# Altium schematic sheet MPU.SchDoc
size 420 x 297 mm; Address1: Address1; Address2: Address2; Address3: Address3; Address4: Address4; SheetNumber: 1; Scale: 1:1; Разраб.: Иванов; Обозначение документа: АБВГ.123456.001 Э3; Пров.: Петров; Утв.: Сидоров; Наименование организации: ОАО "Концерн "МПО-Гидроприбор"; Перв. применение: АБВГ.123456.000; Наименование изделия 1: Плата; Наименование изделия 2: Схема электрическая; Наименование изделия 3: принципиальная; Нач. отд.: Нач. отд.; Фамилия нач. отд.: Сидоров
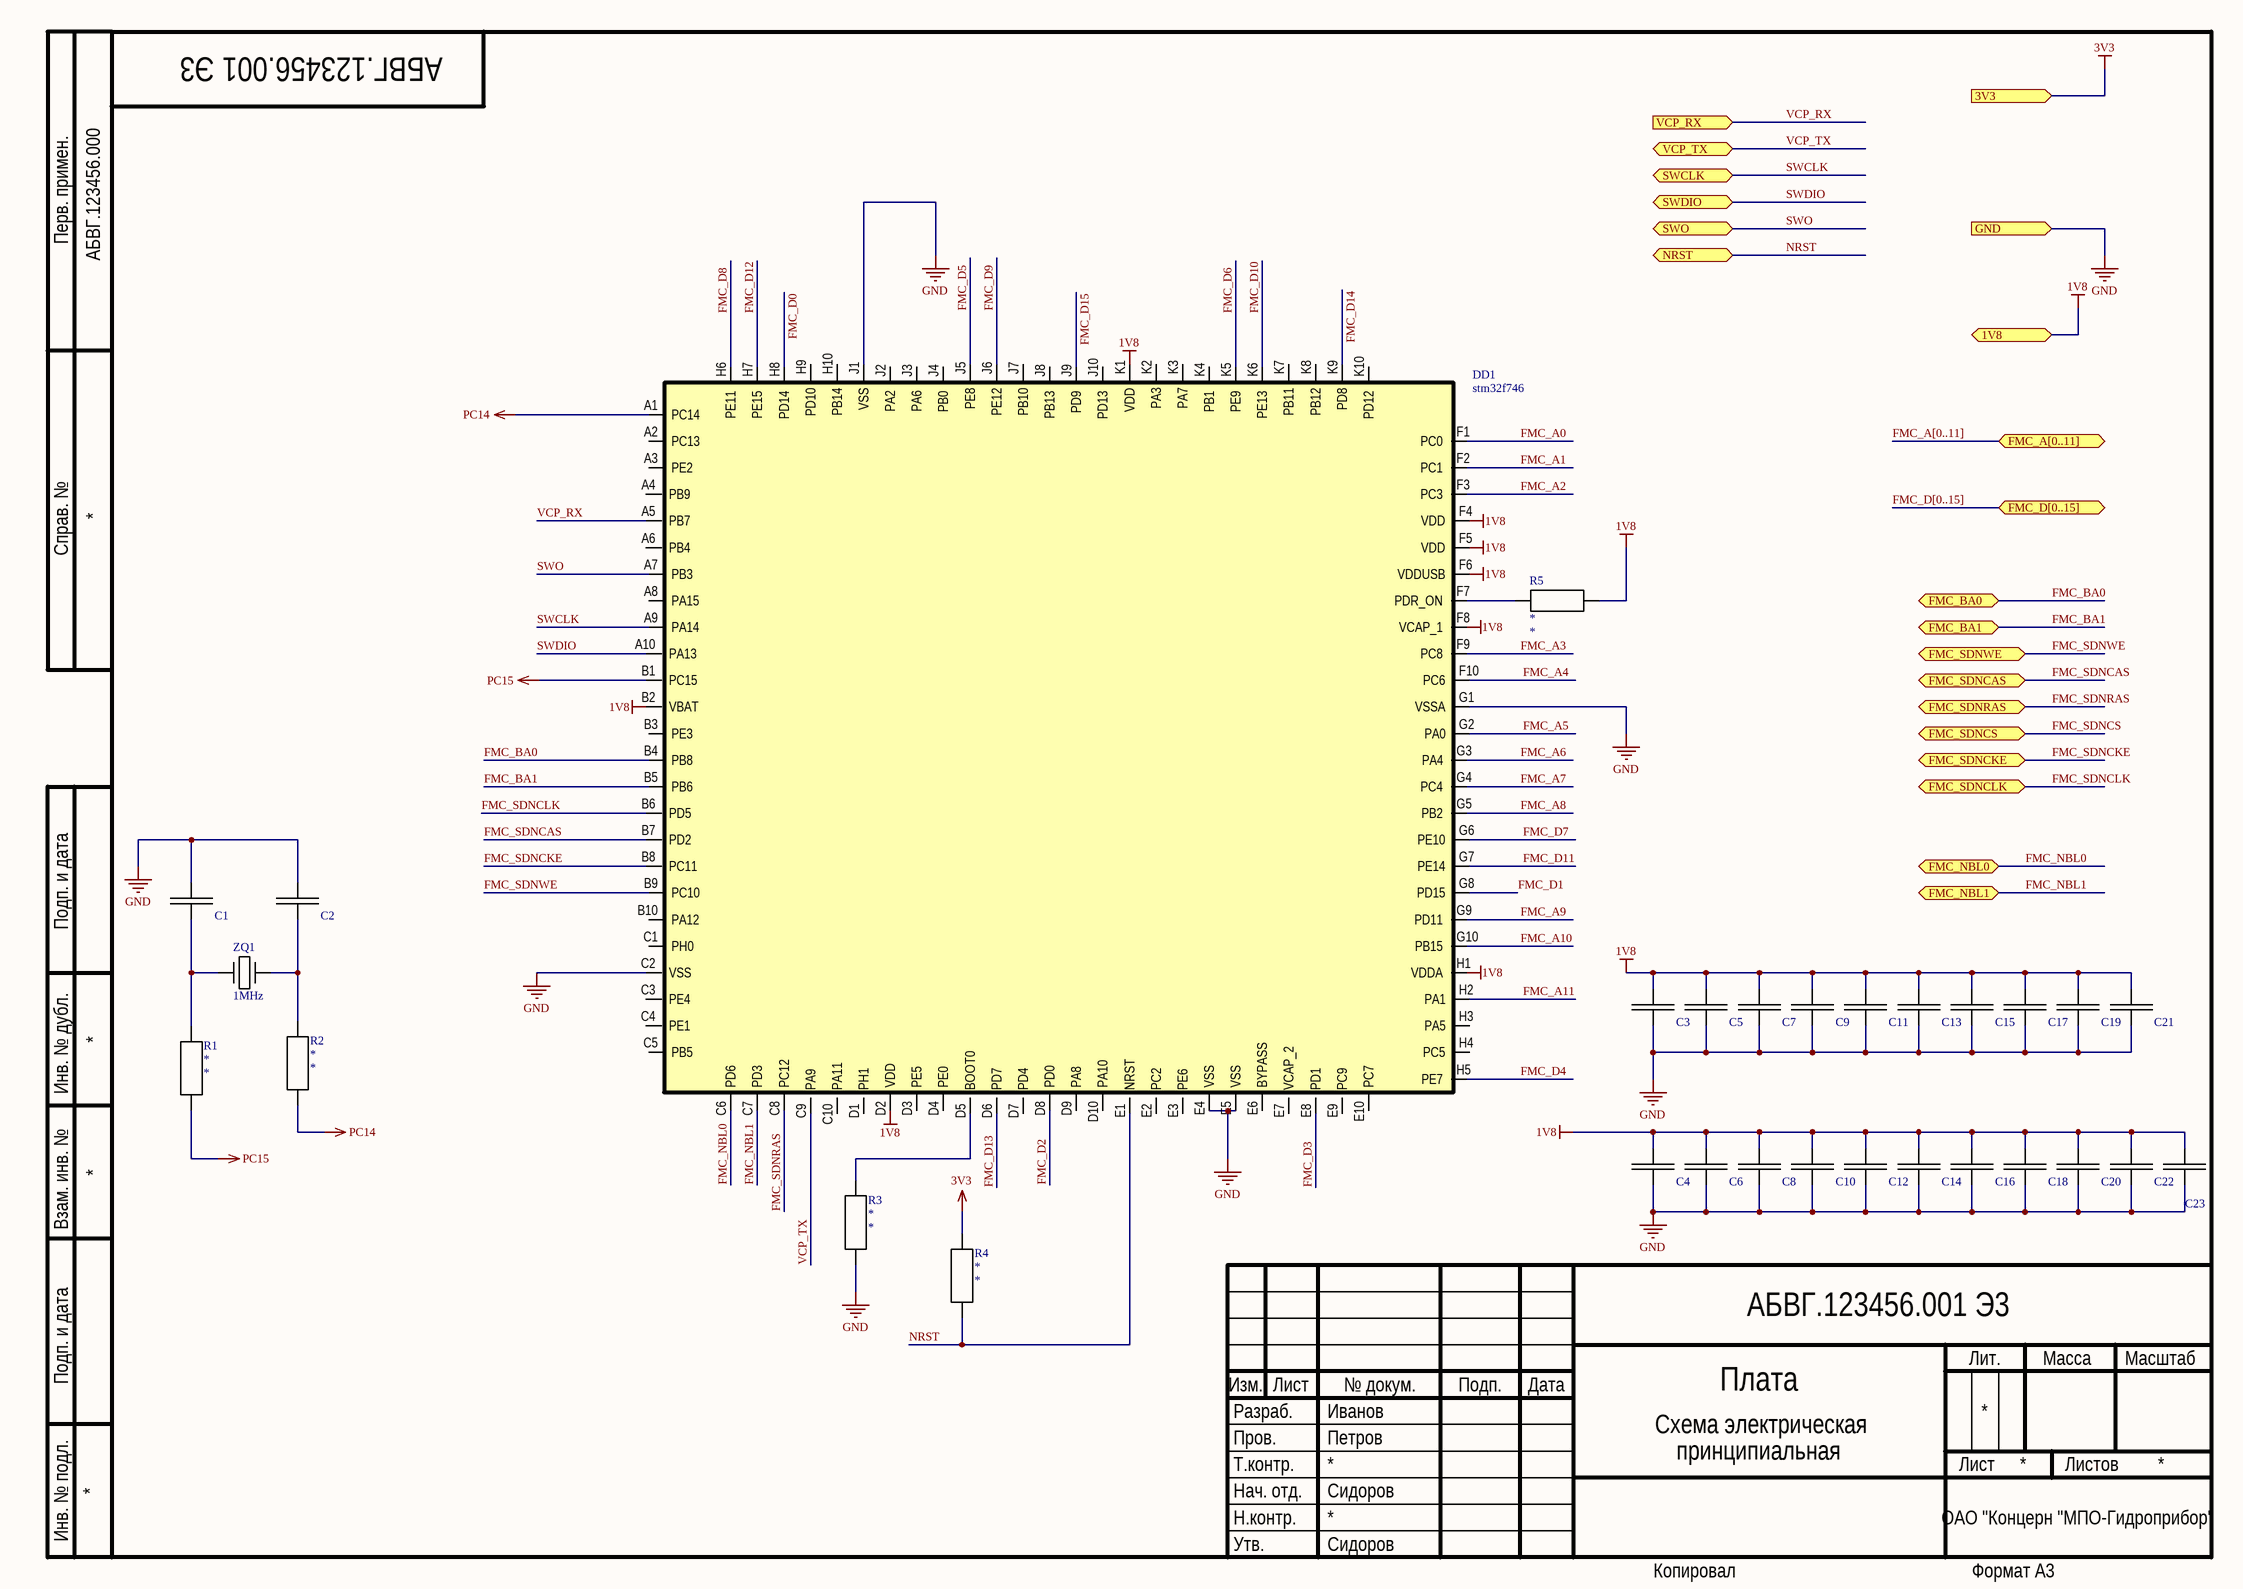
[diagram p0: MPU.SchDoc]

## Parts
C1  *  [CAP0402]  (value not drawn)
C2  *  [CAP0402]  (value not drawn)
C3  *  [CAP0402]  (value not drawn)
C4  *  [CAP0402]  (value not drawn)
C5  *  [CAP0402]  (value not drawn)
C6  *  [CAP0402]  (value not drawn)
C7  *  [CAP0402]  (value not drawn)
C8  *  [CAP0402]  (value not drawn)
C9  *  [CAP0402]  (value not drawn)
C10  *  [CAP0402]  (value not drawn)
C11  *  [CAP0402]  (value not drawn)
C12  *  [CAP0402]  (value not drawn)
C13  *  [CAP0402]  (value not drawn)
C14  *  [CAP0402]  (value not drawn)
C15  *  [CAP0402]  (value not drawn)
C16  *  [CAP0402]  (value not drawn)
C17  *  [CAP0402]  (value not drawn)
C18  *  [CAP0402]  (value not drawn)
C19  *  [CAP0402]  (value not drawn)
C20  *  [CAP0402]  (value not drawn)
C21  *  [CAP0402]  (value not drawn)
C22  *  [CAP0402]  (value not drawn)
C23  *  [CAP0402]  (value not drawn)
DD1  stm32f746  [BGA100P9X9-81A]
R1  *  [0402]
R2  *  [0402]
R3  *  [0402]
R4  *  [0402]
R5  *  [0402]
ZQ1  1MHz  [KX-7]

## Ports
1V8, 3V3 (in), FMC_A[0..11] (bidir), FMC_BA0 (bidir), FMC_BA1 (bidir), FMC_D[0..15] (bidir), FMC_NBL0 (bidir), FMC_NBL1 (bidir), FMC_SDNCAS (bidir), FMC_SDNCKE (bidir), FMC_SDNCLK (bidir), FMC_SDNCS (bidir), FMC_SDNRAS (bidir), FMC_SDNWE (bidir), GND (in), NRST, SWCLK, SWDIO, SWO, VCP_RX (in), VCP_TX

## Nets
1V8: C3.1 C4.1 C5.1 C6.1 C7.1 C8.1 C9.1 C10.1 C11.1 C12.1 C13.1 C14.1 C15.1 C16.1 C17.1 C18.1 C19.1 C20.1 C21.1 C22.1 C23.1 DD1.B2(VBAT) DD1.D2(VDD) DD1.F4(VDD) DD1.F5(VDD) DD1.F6(VDDUSB) DD1.F8(VCAP_1) DD1.H1(VDDA) DD1.K1(VDD) R5.1 ; port 1V8
3V3: R4.2 ; port 3V3
GND: C1.1 C2.1 C3.2 C4.2 C5.2 C6.2 C7.2 C8.2 C9.2 C10.2 C11.2 C12.2 C13.2 C14.2 C15.2 C16.2 C17.2 C18.2 C19.2 C20.2 C21.2 C22.2 C23.2 DD1.C2(VSS) DD1.E4(VSS) DD1.E5(VSS) DD1.G1(VSSA) DD1.J1(VSS) R3.1 ; port GND
PC14: DD1.A1(PC14) R2.1
PC15: DD1.B1(PC15) R1.1
FMC_A0: DD1.F1(PC0)
FMC_A1: DD1.F2(PC1)
FMC_A2: DD1.F3(PC3)
FMC_A3: DD1.F9(PC8)
FMC_A4: DD1.F10(PC6)
FMC_A5: DD1.G2(PA0)
FMC_A6: DD1.G3(PA4)
FMC_A7: DD1.G4(PC4)
FMC_A8: DD1.G5(PB2)
FMC_A9: DD1.G9(PD11)
FMC_A10: DD1.G10(PB15)
FMC_A11: DD1.H2(PA1)
FMC_BA0: DD1.B4(PB8) ; port FMC_BA0
FMC_BA1: DD1.B5(PB6) ; port FMC_BA1
FMC_D0: DD1.H8(PD14)
FMC_D1: DD1.G8(PD15)
FMC_D2: DD1.D8(PD0)
FMC_D3: DD1.E8(PD1)
FMC_D4: DD1.H5(PE7)
FMC_D5: DD1.J5(PE8)
FMC_D6: DD1.K5(PE9)
FMC_D7: DD1.G6(PE10)
FMC_D8: DD1.H6(PE11)
FMC_D9: DD1.J6(PE12)
FMC_D10: DD1.K6(PE13)
FMC_D11: DD1.G7(PE14)
FMC_D12: DD1.H7(PE15)
FMC_D13: DD1.D6(PD7)
FMC_D14: DD1.K9(PD8)
FMC_D15: DD1.J9(PD9)
FMC_NBL0: DD1.C6(PD6) ; port FMC_NBL0
FMC_NBL1: DD1.C7(PD3) ; port FMC_NBL1
FMC_SDNCAS: DD1.B7(PD2) ; port FMC_SDNCAS
FMC_SDNCKE: DD1.B8(PC11) ; port FMC_SDNCKE
FMC_SDNCLK: DD1.B6(PD5) ; port FMC_SDNCLK
FMC_SDNCS: port FMC_SDNCS
FMC_SDNRAS: DD1.C8(PC12) ; port FMC_SDNRAS
FMC_SDNWE: DD1.B9(PC10) ; port FMC_SDNWE
NRST: DD1.E1(NRST) R4.1 ; port NRST
SWCLK: DD1.A9(PA14) ; port SWCLK
SWDIO: DD1.A10(PA13) ; port SWDIO
SWO: DD1.A7(PB3) ; port SWO
VCP_RX: DD1.A5(PB7) ; port VCP_RX
VCP_TX: DD1.C9(PA9) ; port VCP_TX
NetC1_2: C1.2 R1.2 ZQ1.1
NetC2_2: C2.2 R2.2 ZQ1.3
NetDD1_D5: DD1.D5(BOOT0) R3.2
NetDD1_F7: DD1.F7(PDR_ON) R5.2

Not connected (* = marked no-connect by the designer): DD1 A2(PC13) A3(PE2) A4(PB9) A6(PB4) A8(PA15) B3(PE3) B10(PA12) C1(PH0) C3(PE4) C4(PE1) C5(PB5) C10(PA11) D1(PH1) D3(PE5) D4(PE0) D7(PD4) D9(PA8) D10(PA10) E2(PC2) E3(PE6) E6(BYPASS) E7(VCAP_2) E9(PC9) E10(PC7) H3(PA5) H4(PC5) H9(PD10) H10(PB14) J2(PA2) J3(PA6) J4(PB0) J7(PB10) J8(PB13) J10(PD13) K2(PA3) K3(PA7) K4(PB1) K7(PB11) K8(PB12) K10(PD12)

## Buses and harness runs
bus FMC_A[0..11] = port FMC_A[0..11]
bus FMC_D[0..15] = port FMC_D[0..15]

## Notes on the sheet
- Перв. примен.
- Справ. №
- Подп. и дата
- Инв. № дубл.
- Взам. инв. №
- Разраб.
- Изм.
- Лист
- № докум.
- Подп.
- Дата
- Лит.
- Масса
- Масштаб
- Пров.
- Т.контр.
- Листов
- Инв. № подл.
- Утв.
- Н.контр.
- Копировал
- Формат А3

## Library data of the parts
C1-C23 = Capasitor: Value: *; Voltage: *; Part Number: *; Quantity: *; Package: *; Price: *; Manufacturer: *; ShoppingPlace: *
DD1 = stm32f746: Manufacturer: STM; Part Number: stm32f746; Package: LQFP48; Quantity: 1
R1-R5 = Resistor: Manufacturer: *; Quntity: *; Price: *; Part Number: *; Package: *; Value: *; Power: *
ZQ1 = Rzanator: Part Number: HC-51; Manufacturer: CHina; Value: 1MHz; Package: HC-51; Quantity: 1; Price: 13; ShoppingPlace: https://ru.aliexpress.com/item/1-MHz-Quartz-Crystal-Resonator-HC-51-U-1-000-MHz-1000-KHz/32542776281.html?ws_ab_test=searchweb0_0,searchweb201602_2_10152_10151_10065_10344_10068_10342_10343_10340_10341_10697_10696_10084_5722520_10083_10618_10307_10059_5722620_5722920_10534_308_5722720_5722820_100031_10103_441_10624_10623_10622_10621_10620,searchweb201603_68,ppcSwitch_5&algo_expid=89d4295e-121a-47e9-b7f5-26405723b7a9-0&algo_pvid=89d4295e-121a-47e9-b7f5-26405723b7a9&transAbTest=ae803_2&priceBeautifyAB=0